# EAGLE board mainboard (EAGLE 9.1.3)
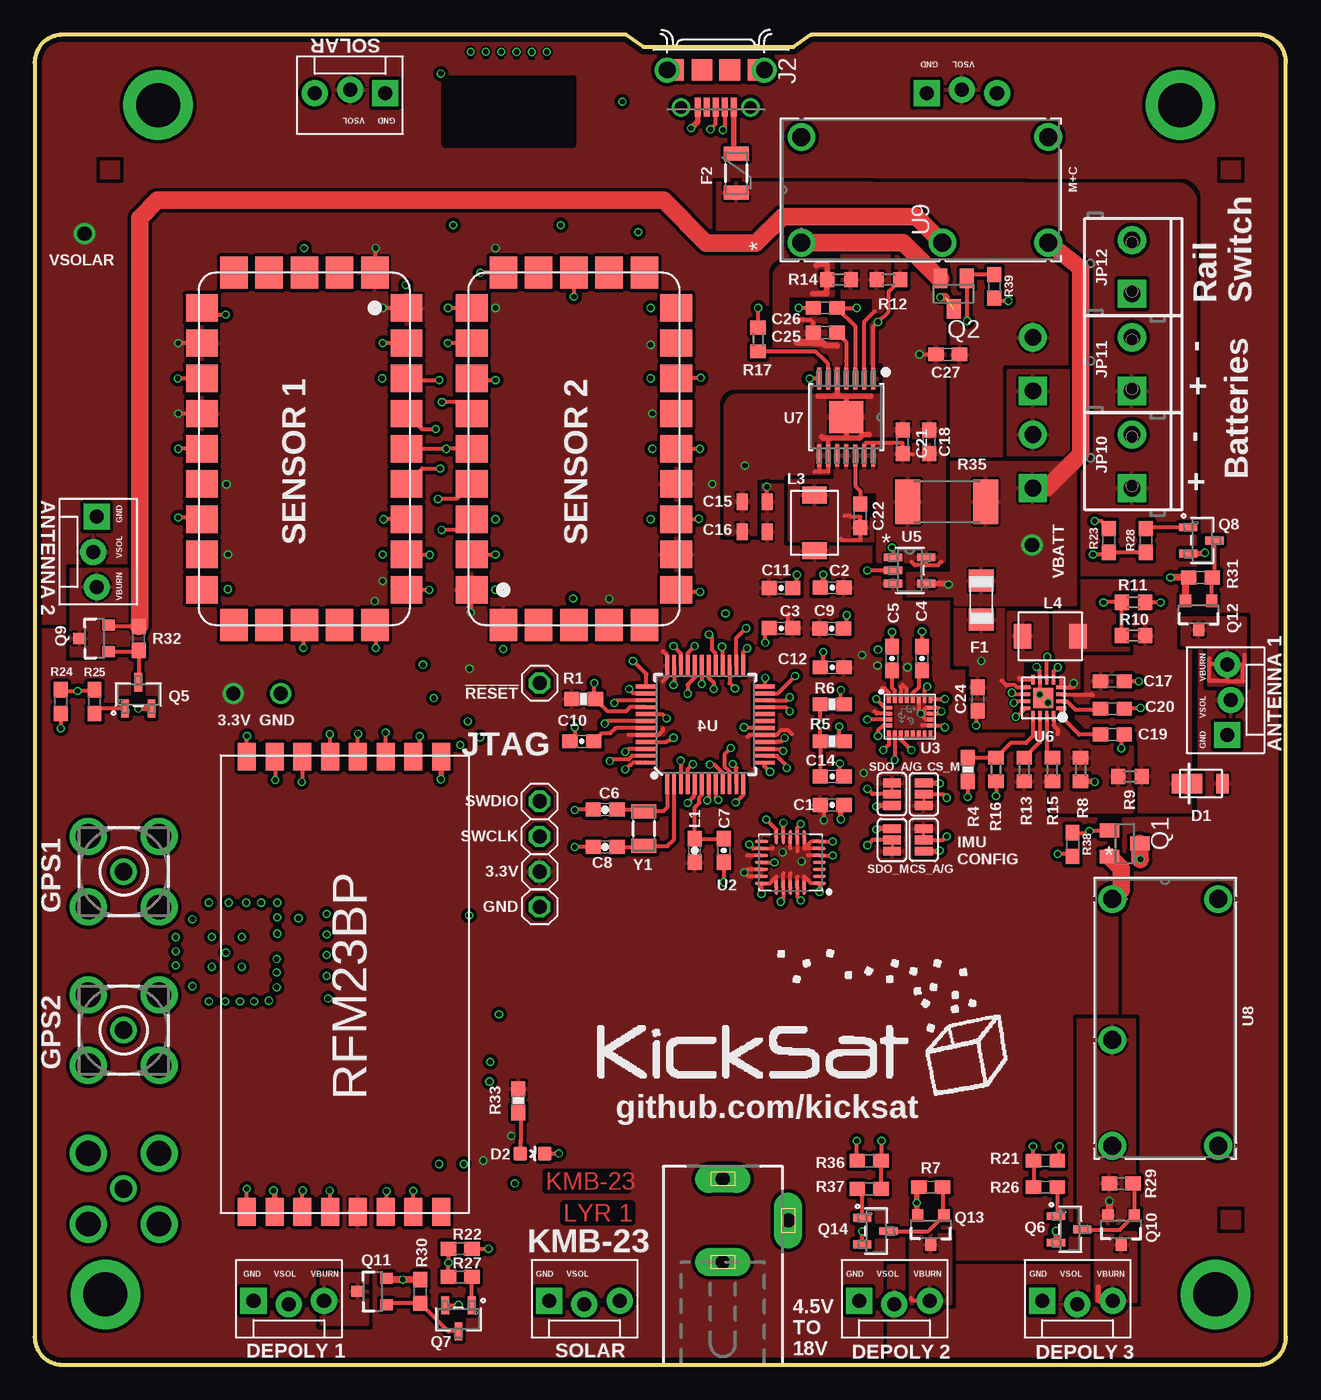
[diagram p5: board, top side]
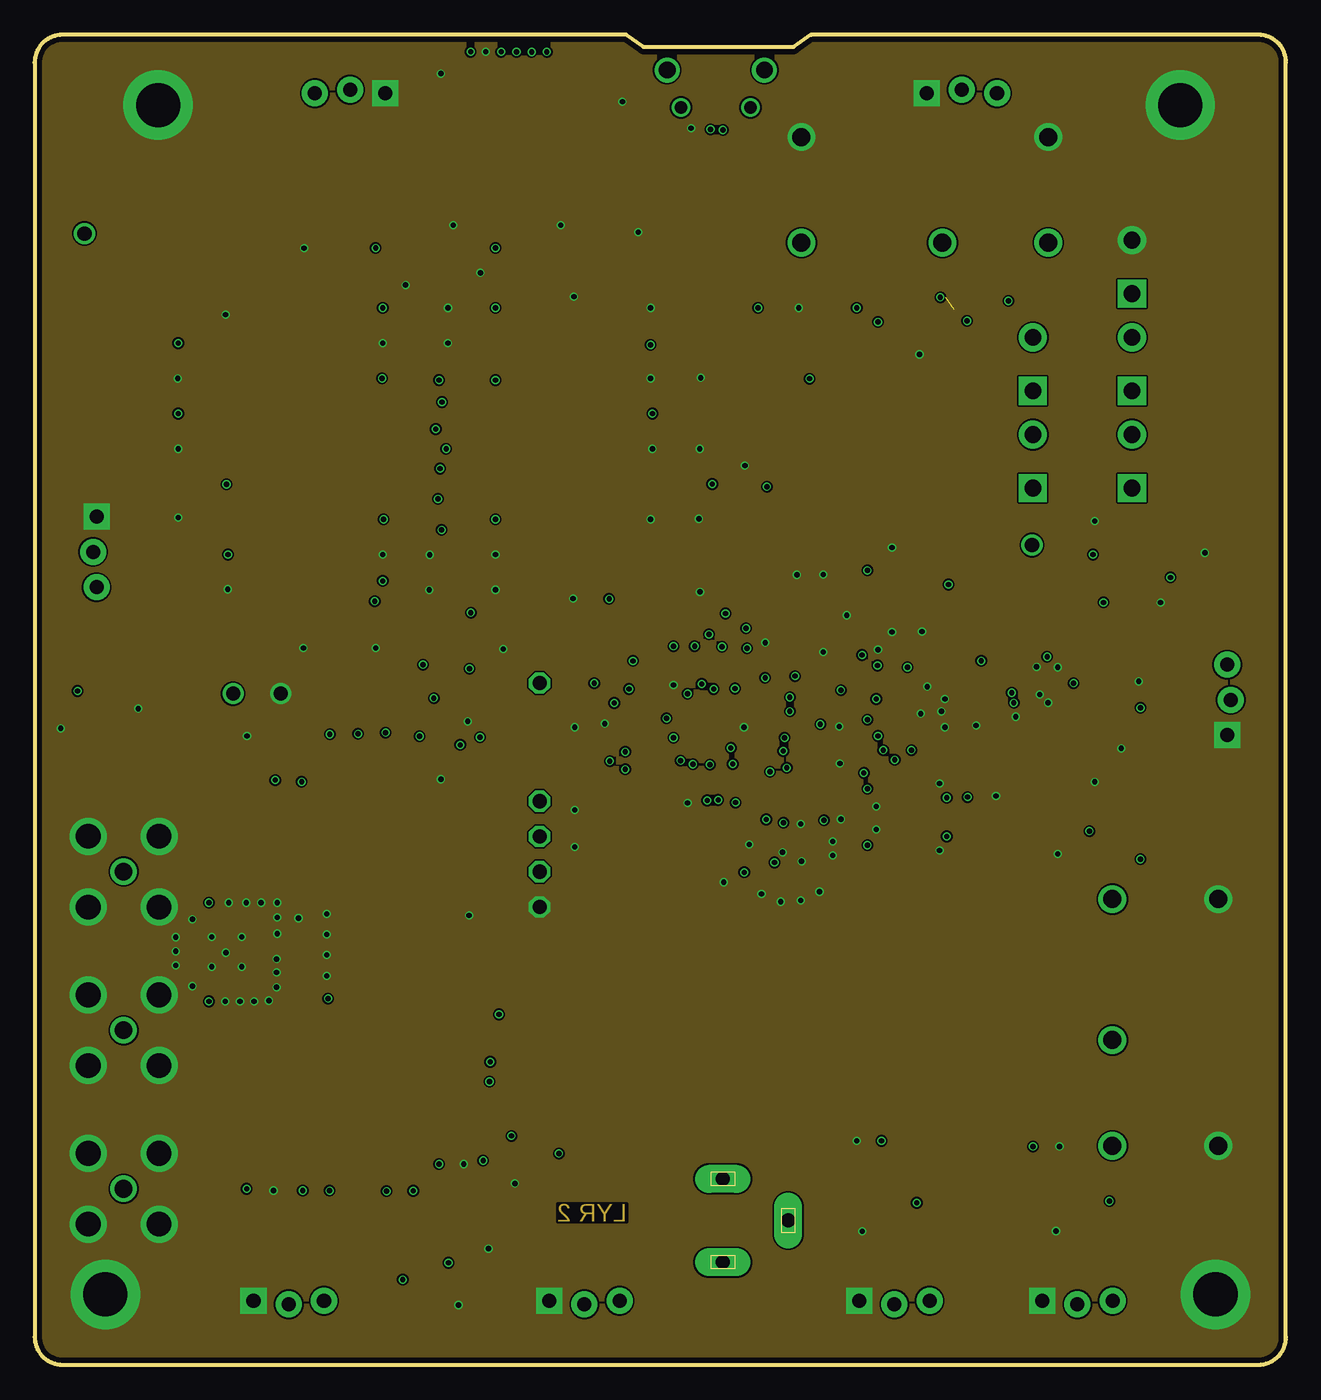
[diagram p6: board, inner layer Route2]
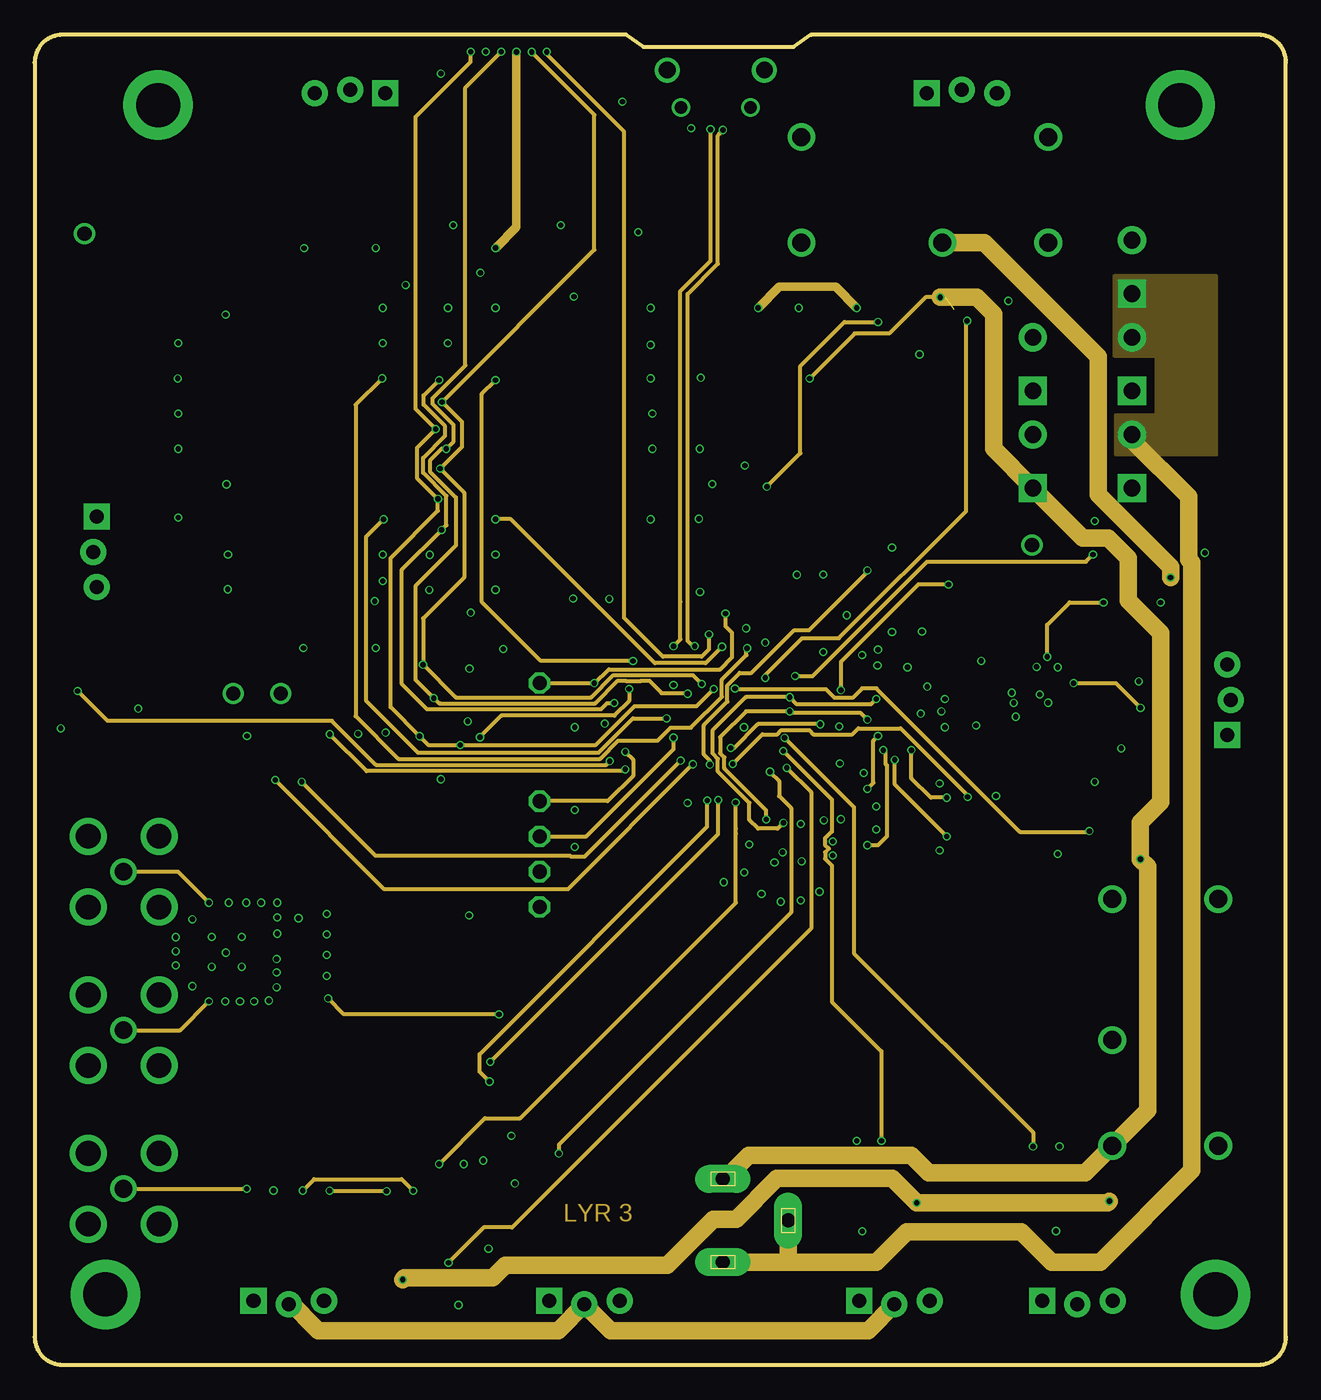
[diagram p7: board, inner layer Route15]
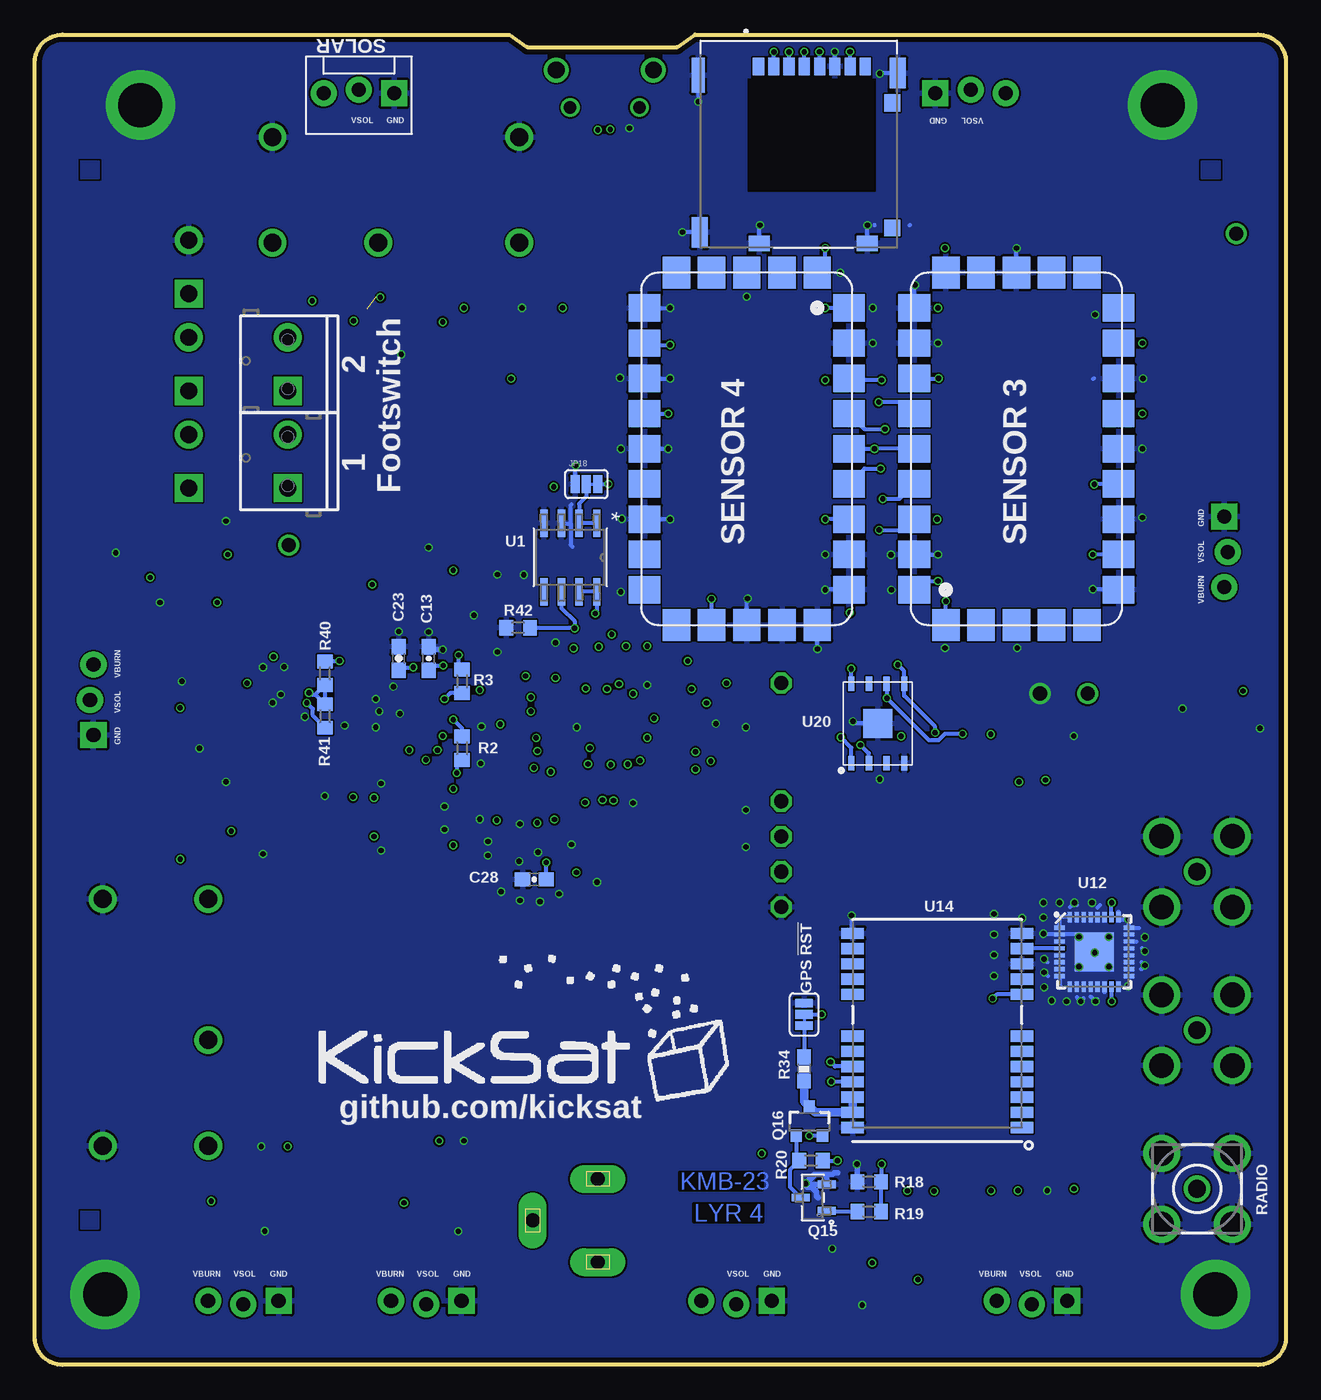
[diagram p8: board, bottom side, seen from below]

Size 90.17 x 95.89 mm. Coordinates in mm from the lower left corner, seen from the top.
Outline: 0,93.89 0,2 arc90 2,0 88.17,0 arc90 90.17,2 90.17,93.89 arc90 88.17,95.89 55.94,95.88 54.67,94.99 43.88,94.99 42.59,95.89 2,95.89 arc90 0,93.89
Copper layers (1*2*15*16): Top 0.035559375mm / dielectric 0.17018125mm / Route2 0.01778125mm / dielectric 47mil / Route15 0.01778125mm / dielectric 0.17018125mm / Bottom 0.035559375mm
Design rules "oshpark-4layer *": minimum track width 5mil, minimum drill 10mil, track to track 5mil, track to pad 5mil, pad to pad 5mil, via to via 5mil, smd to smd 5mil, copper to edge 15mil, drill to drill 6mil, minimum pad ring 4mil, minimum via ring 4mil, stop-mask expansion 2.5mil, vias tented up to drill 0mil, thermal gap 7mil
Net classes: 0 default: width 0.272 mm, drill 0.381 mm, clearance 0.127 mm

## Footprints (pad centres in the part's own frame; a part is rotated, then mirrored left to right if it is on the bottom)
1X01 = drill 1.016 octagon: 1 0,0
0603-CAP = smd 1.1 x 1: 1 -0.85,0; 2 0.85,0
0603-CAP@1 = smd 1.1 x 1: 1 -0.85,0; 2 0.85,0
0805 = smd 0.8 x 1.2: 1 -0.9,0; 2 0.9,0
0603 = smd 1.1 x 1: 1 -0.85,0; 2 0.85,0
PWRDI-123 = smd 0.9 x 1.4: A 1.45,0 | smd 2.2 x 1.4: C -1.1,0
LED-0603 = smd 1 x 1: A 0,-0.877; C 0,0.877
1206 = smd 1.6 x 1.8: 1 -1.4,0; 2 1.4,0
PTC-1206 = smd 1 x 1.8: 1 -1.4,0; 2 1.4,0
MOLEX_503182-1852 = smd 0.8 x 1.24: 1 -2.9,6.355; 2 -1.8,6.355; 3 -0.7,6.355; 4 0.4,6.355; 5 1.5,6.355; 6 2.6,6.355; 7 3.7,6.355; 8 4.8,6.355 | smd 1.16 x 1.2: DT 6.74,-5.275 | smd 0.95 x 2.5: P1 -7.245,5.725 | smd 1.15 x 2.2: P2 7.145,5.875; P3 -7.145,-5.605 | smd 1.5 x 1.15: P4 -2.84,-6.4; P5 4.94,-6.4 | smd 1.16 x 1.25: SW 6.74,3.725
FRAMATOME_10118194-0001LF = smd 0.45 x 1.35: 1 -1.3,2.675; 2 -0.65,2.675; 3 0,2.675; 4 0.65,2.675; 5 1.3,2.675 | drill 0.9: P$6 -2.5,2.7; P$7 2.5,2.7 | drill 1.2: P$8 -3.5,0; P$9 3.5,0 | smd 1.5 x 1.55: P$10 -1,0; P$11 1,0; P$12 -3.05,0; P$13 3.05,0
DCJ0303 = drill 1 pad 2 long: 1 0,3; 2 4.7,0; 3 0,-3
PAD-JUMPER-3-2OF3_NC_BY_TRACE_YES_SILK_FULL_BOX = smd 0.635 x 1.27: 1 -0.813,0; 2 0,0; 3 0.813,0
MOLEX-1X3_LOCK = drill 1.016 pad 1.88 square: 1 0,0.127 | drill 1.016 pad 1.88: 2 2.54,-0.127; 3 5.08,0.127
SCREWTERMINAL-3.5MM-2_LOCK = drill 1.2 pad 2.032 square: 1 -0.178,0 | drill 1.2 pad 2.032: 2 3.678,0
1812 = smd 1.25 x 1.75: P$1 -2,0; P$2 2,0
SOT23 = smd 1 x 1.4: 1 -0.95,-1.1; 2 0.95,-1.1; 3 0,1.1
SOT-23 = smd 0.559 x 1.321: 1 -0.953,-1.003; 2 0.953,-1.003; 3 0,0.876
SOT23-3 = smd 0.8 x 0.9: 1 -0.95,-1; 2 0.95,-1; 3 0,1.1
0603-RES = smd 1.1 x 1: 1 -0.85,0; 2 0.85,0
R0603 = smd 1 x 1.1: 1 -0.85,0; 2 0.85,0
R2512 = smd 1.8 x 3.2: 1 -2.8,0; 2 2.8,0
SO8 = smd 1.981 x 0.533: 1 -2.464,1.905; 2 -2.464,0.635; 3 -2.464,-0.635; 4 -2.464,-1.905; 5 2.464,-1.905; 6 2.464,-0.635; 7 2.464,0.635; 8 2.464,1.905
QFN50P456X400X100-24 = smd 0.998 x 0.22: 1 -2.086,1.5; 2 -2.086,1; 3 -2.086,0.5; 4 -2.086,0; 5 -2.086,-0.5; 6 -2.086,-1; 7 -2.086,-1.5; 13 2.086,-1.5; 14 2.086,-1; 15 2.086,-0.5; 16 2.086,0; 17 2.086,0.5; 18 2.086,1; 19 2.086,1.5 | smd 0.22 x 1.062: 8 -1,-1.819; 9 -0.5,-1.819; 10 0,-1.819; 11 0.5,-1.819; 12 1,-1.819; 20 1,1.819; 21 0.5,1.819; 22 0,1.819; 23 -0.5,1.819; 24 -1,1.819
LGA24-8X4 = smd 0.27 x 0.45: 1 -1.505,1.225; 6 -1.505,-1.225; 7 -1.075,-1.225; 8 -0.645,-1.225; 9 -0.215,-1.225; 10 0.215,-1.225; 11 0.645,-1.225; 12 1.075,-1.225; 13 1.505,-1.225; 18 1.505,1.225; 19 1.075,1.225; 20 0.645,1.225; 21 0.215,1.225; 22 -0.215,1.225; 23 -0.645,1.225; 24 -1.075,1.225 | smd 0.45 x 0.27: 2 -1.475,0.645; 3 -1.475,0.215; 4 -1.475,-0.215; 5 -1.475,-0.645; 14 1.475,-0.645; 15 1.475,-0.215; 16 1.475,0.215; 17 1.475,0.645
TQFP-48 = smd 1.5 x 0.28: 1 -4.25,2.75; 2 -4.25,2.25; 3 -4.25,1.75; 4 -4.25,1.25; 5 -4.25,0.75; 6 -4.25,0.25; 7 -4.25,-0.25; 8 -4.25,-0.75; 9 -4.25,-1.25; 10 -4.25,-1.75; 11 -4.25,-2.25; 12 -4.25,-2.75; 25 4.25,-2.75; 26 4.25,-2.25; 27 4.25,-1.75; 28 4.25,-1.25; 29 4.25,-0.75; 30 4.25,-0.25; 31 4.25,0.25; 32 4.25,0.75; 33 4.25,1.25; 34 4.25,1.75; 35 4.25,2.25; 36 4.25,2.75 | smd 0.28 x 1.5: 13 -2.75,-4.25; 14 -2.25,-4.25; 15 -1.75,-4.25; 16 -1.25,-4.25; 17 -0.75,-4.25; 18 -0.25,-4.25; 19 0.25,-4.25; 20 0.75,-4.25; 21 1.25,-4.25; 22 1.75,-4.25; 23 2.25,-4.25; 24 2.75,-4.25; 37 2.75,4.25; 38 2.25,4.25; 39 1.75,4.25; 40 1.25,4.25; 41 0.75,4.25; 42 0.25,4.25; 43 -0.25,4.25; 44 -0.75,4.25; 45 -1.25,4.25; 46 -1.75,4.25; 47 -2.25,4.25; 48 -2.75,4.25
21-0057F = smd 1.321 x 0.559: 1 -1.194,0.95; 2 -1.194,0; 3 -1.194,-0.95; 4 1.194,-0.95; 5 1.194,0.95
QFN-16-PAD = smd 0.7 x 0.25: P$1 -1.3,0.75; P$2 -1.3,0.25; P$3 -1.3,-0.25; P$4 -1.3,-0.75; P$9 1.3,-0.75; P$10 1.3,-0.25; P$11 1.3,0.25; P$12 1.3,0.75 | smd 0.25 x 0.7: P$5 -0.75,-1.3; P$6 -0.25,-1.3; P$7 0.25,-1.3; P$8 0.75,-1.3; P$13 0.75,1.3; P$14 0.25,1.3; P$15 -0.25,1.3; P$16 -0.75,1.3 | smd 1.45 x 1.45: P$17 0,0
PWP14_2P31X2P46-L = smd 1.6 x 0.305: 1 -2.769,1.95; 2 -2.769,1.3; 3 -2.769,0.65; 4 -2.769,0; 5 -2.769,-0.65; 6 -2.769,-1.3; 7 -2.769,-1.95; 8 2.769,-1.95; 9 2.769,-1.3; 10 2.769,-0.65; 11 2.769,0; 12 2.769,0.65; 13 2.769,1.3; 14 2.769,1.95 | smd 2.31 x 2.46: 15 0,0
RELAY5-PE_CO = drill 1.295 pad 2.007: 1 -7.62,17.196; 5 0,17.196; 11 -7.62,7.036; 12 0,-0.584; 14 -7.62,-0.584
QFN32-5X5MM = smd 0.762 x 0.305: 1 -2.5,1.75; 2 -2.5,1.25; 3 -2.5,0.75; 4 -2.5,0.25; 5 -2.5,-0.25; 6 -2.5,-0.75; 7 -2.5,-1.25; 8 -2.5,-1.75; 17 2.5,-1.75; 18 2.5,-1.25; 19 2.5,-0.75; 20 2.5,-0.25; 21 2.5,0.25; 22 2.5,0.75; 23 2.5,1.25; 24 2.5,1.75 | smd 0.305 x 0.762: 9 -1.75,-2.5; 10 -1.25,-2.5; 11 -0.75,-2.5; 12 -0.25,-2.5; 13 0.25,-2.5; 14 0.75,-2.5; 15 1.25,-2.5; 16 1.75,-2.5; 25 1.75,2.5; 26 1.25,2.5; 27 0.75,2.5; 28 0.25,2.5; 29 -0.25,2.5; 30 -0.75,2.5; 31 -1.25,2.5; 32 -1.75,2.5 | smd 2.794 x 2.794: EP 0,0
RFM23BP = smd 2 x 1.3: ANT 16.9,-7.5; GND1 -15.9,6.5; GND2 -15.9,-7.5; GND3 16.9,-5.5; GPIO_0 16.9,2.5; GPIO_1 16.9,4.5; GPIO_2 16.9,6.5; NIRQ -15.9,-3.5; NSEL -15.9,-1.5; RXON 16.9,-1.5; SCK -15.9,0.5; SDI -15.9,2.5; SDN -15.9,-5.5; SDO -15.9,4.5; TXON 16.9,-3.5; VCC 16.9,0.5
S1216_24PIN_PACKAGE = smd 1.626 x 0.813: 1 5.85,-7.62; 2 5.85,-6.52; 3 5.85,-5.42; 4 5.85,-4.32; 5 5.85,-3.22; 6 5.85,-2.12; 7 5.85,-1.02; 8 5.85,1.98; 9 5.85,3.08; 10 5.85,4.18; 11 5.85,5.28; 12 5.85,6.38; 13 -6.35,6.38; 14 -6.35,5.28; 15 -6.35,4.18; 16 -6.35,3.08; 17 -6.35,1.98; 18 -6.35,-1.02; 19 -6.35,-2.12; 20 -6.35,-3.22; 21 -6.35,-4.32; 22 -6.35,-5.42; 23 -6.35,-6.52; 24 -6.35,-7.62
XTB28_MEZ = smd 2.286 x 1.981: P$1 0.254,2.54; P$2 0.254,5.08; P$3 0.254,7.62; P$4 0.254,10.16; P$5 0.254,12.7; P$6 0.254,15.24; P$7 0.254,17.78; P$8 0.254,20.32; P$9 0.254,22.86; P$15 14.986,22.86; P$16 14.986,20.32; P$17 14.986,17.78; P$18 14.986,15.24; P$19 14.986,12.7; P$20 14.986,10.16; P$21 14.986,7.62; P$22 14.986,5.08; P$23 14.986,2.54 | smd 1.981 x 2.286: P$10 2.54,25.4; P$11 5.08,25.4; P$12 7.62,25.4; P$13 10.16,25.4; P$14 12.7,25.4; P$24 12.7,0; P$25 10.16,0; P$26 7.62,0; P$27 5.08,0; P$28 2.54,0
SON127P600X500X90-9N = smd 1.05 x 0.45: 1 -2.85,1.905; 2 -2.85,0.635; 3 -2.85,-0.635; 4 -2.85,-1.905; 5 2.85,-1.905; 6 2.85,-0.635; 7 2.85,0.635; 8 2.85,1.905 | smd 2.1 x 2.1: 9 0,0
BU-SMA-V = drill 1.27: 1 0,0 | drill 1.778: 2 -2.55,2.55; 3 2.55,2.55; 4 2.55,-2.55; 5 -2.55,-2.55
CRYSTAL-SMD-3.2X1.5MM = smd 1 x 1.8: P$1 -1.25,0; P$2 1.25,0

## Placement (x,y rotation side)
3.3V  [1X01]  36.38,35.55 0 top
C1  10uF  [0603-CAP]  57.46,40.35 0 top
C2  0.1uF  [0603-CAP]  57.46,56.02 180 top
C3  0.1uF  [0603-CAP]  53.78,53.1 180 top
C4  10nF  [0603-CAP]  63.94,50.92 90 top
C5  0.1uF  [0603-CAP]  61.78,50.92 90 top
C6  15pF  [0603-CAP@1]  41.11,40.02 0 top
C7  0.1uF  [0603-CAP]  49.65,37.07 270 top
C8  15pF  [0603-CAP@1]  41.11,37.33 180 top
C9  0.1uF  [0603-CAP]  57.44,53.08 0 top
C10  0.1uF  [0603-CAP]  39.43,44.95 180 top
C11  0.1uF  [0603-CAP]  53.78,56 0 top
C12  0.1uF  [0603-CAP]  57.46,50.28 180 top
C13  0.1uF  [0603-CAP]  61.78,50.92 90 bottom
C14  0.1uF  [0603-CAP]  57.46,42.41 0 top
C15  22uF  [0805]  51.88,62.22 0 top
C16  22uF  [0805]  51.88,60.06 0 top
C17  10uF  [0603]  77.66,49.28 0 top
C18  10uF  [0603]  64.45,66.54 90 top
C19  2.2uF  [0603]  77.66,45.44 0 top
C20  22nF  [0603]  77.66,47.29 0 top
C21  10uF  [0603]  62.54,66.54 90 top
C22  0.1uF  [0603]  59.5,61.2 90 top
C23  .1uF  [0603-CAP@1]  63.94,50.92 90 bottom
C24  22uF  [0603]  67.97,48 270 top
C25  3.3nF  [0603]  56.96,74.41 180 top
C26  1.0uF  [0603]  56.96,76.19 180 top
C27  2.2uF  [0603]  65.8,72.84 180 top
C28  0.1uF  [0603-CAP]  54.16,34.99 0 bottom
D1  DFLS130L  [PWRDI-123]  84.13,41.9 0 top
D2  GREEN  [LED-0603]  35.87,15.23 270 top
F1  1206L200  [1206]  68.21,55.13 90 top
F2  500mA  [PTC-1206]  50.56,85.89 270 top
FRAME1  FRAME-LETTER  [CREATIVE_COMMONS]  -4.77,87.11 0 top  (outside the outline)
FRAME2  FRAME-LETTER  [CREATIVE_COMMONS]  -4.46,78.22 0 top  (outside the outline)
FRAME3  FRAME-LETTER  [CREATIVE_COMMONS]  -4.77,60.44 0 top  (outside the outline)
FRAME4  FRAME-LETTER  [CREATIVE_COMMONS]  -4.77,69.33 0 top  (outside the outline)
FRAME5  FRAME-LETTER  [CREATIVE_COMMONS]  -4.77,54.85 0 top  (outside the outline)
GND  [1X01]  36.38,33.01 0 top
J1  503182-1852  [MOLEX_503182-1852]  35.11,87.24 0 bottom
J2  10118194-0001LF  [FRAMATOME_10118194-0001LF]  49.08,93.34 180 top
J3  DCJ0303  [DCJ0303]  49.59,10.4 0 top
JP1  [PAD-JUMPER-3-2OF3_NC_BY_TRACE_YES_SILK_FULL_BOX]  61.78,37.84 270 top
JP2  [PAD-JUMPER-3-2OF3_NC_BY_TRACE_YES_SILK_FULL_BOX]  61.78,41.14 90 top
JP3  [PAD-JUMPER-3-2OF3_NC_BY_TRACE_YES_SILK_FULL_BOX]  64.07,41.14 270 top
JP4  [PAD-JUMPER-3-2OF3_NC_BY_TRACE_YES_SILK_FULL_BOX]  64.07,37.84 90 top
JP5  [MOLEX-1X3_LOCK]  86.06,45.39 90 top
JP6  [MOLEX-1X3_LOCK]  4.34,61.14 270 top
JP7  [MOLEX-1X3_LOCK]  59.41,4.49 0 top
JP8  [MOLEX-1X3_LOCK]  72.6,4.49 0 top
JP9  [MOLEX-1X3_LOCK]  15.77,4.49 0 top
JP10  M023.5MM_LOCK  [SCREWTERMINAL-3.5MM-2_LOCK]  79.07,63.38 90 top
JP11  M023.5MM_LOCK  [SCREWTERMINAL-3.5MM-2_LOCK]  79.07,70.38 90 top
JP12  M023.5MM_LOCK  [SCREWTERMINAL-3.5MM-2_LOCK]  79.07,77.39 90 top
JP13  M023.5MM_LOCK  [SCREWTERMINAL-3.5MM-2_LOCK]  71.93,70.38 90 bottom
JP14  [MOLEX-1X3_LOCK]  37.07,4.49 0 top
JP15  [MOLEX-1X3_LOCK]  64.27,91.79 180 bottom
JP16  M023.5MM_LOCK  [SCREWTERMINAL-3.5MM-2_LOCK]  71.93,63.38 90 bottom
JP17  [MOLEX-1X3_LOCK]  25.27,91.79 180 top
JP18  [PAD-JUMPER-3-2OF3_NC_BY_TRACE_YES_SILK_FULL_BOX]  50.42,63.49 0 bottom
JP24  [PAD-JUMPER-3-2OF3_NC_BY_TRACE_YES_SILK_FULL_BOX]  34.73,25.26 270 bottom
JP25  [1X01]  36.38,40.63 90 top
JP26  [1X01]  36.38,38.09 90 top
JP27  [1X01]  36.38,49.14 0 top
L1  FB - 30Ohm  [0603]  47.56,37.07 90 top
L2  KICKSAT_LOGO  [KICKSAT_LOGO]  40.07,19.17 0 top
L3  3.3uH  [1812]  56.19,60.7 90 top
L4  56uH  [1812]  73.19,52.52 180 top
L5  KICKSAT_LOGO  [KICKSAT_LOGO]  70.16,18.79 0 bottom
Q1  BC846  [SOT23]  78.55,37.58 270 top
Q2  BC846  [SOT23]  66.23,77.21 180 top
Q5  IRLML2803  [SOT-23]  7.46,48.32 0 top
Q6  IRLML2803  [SOT-23]  74.61,9.77 270 top
Q7  IRLML2803  [SOT-23]  30.54,3.29 180 top
Q8  IRLML2803  [SOT-23]  84.13,59.43 270 top
Q9  IRLML5103  [SOT23-3]  4.32,52.37 90 top
Q10  IRLML5103  [SOT23-3]  78.29,9.77 180 top
Q11  IRLML5103  [SOT23-3]  24.36,5.29 90 top
Q12  IRLML5103  [SOT23-3]  83.88,54.09 180 top
Q13  IRLML5103  [SOT23-3]  64.58,9.77 180 top
Q14  IRLML2803  [SOT-23]  60.64,9.64 270 top
Q15  IRLML2803  [SOT-23]  34.1,12.06 90 bottom
Q16  IRLML5103  [SOT23-3]  34.35,17.52 0 bottom
R1  10K  [0603-RES]  39.56,48 180 top
R2  4.7k  [R0603]  59.37,44.44 270 bottom
R3  4.7k  [R0603]  59.37,49.27 90 bottom
R4  10k  [0603-RES]  67.24,42.92 270 top
R5  110K  [0603-RES]  57.46,44.95 180 top
R6  316K  [0603-RES]  57.46,47.62 0 top
R7  100k  [0603]  64.58,12.82 180 top
R8  100K  [R0603]  75.37,42.92 270 top
R9  40.9K  [R0603]  78.93,42.41 0 top
R10  330K  [R0603]  79.18,52.57 0 top
R11  43K  [R0603]  79.18,54.97 180 top
R12  73.2K  [R0603]  61.53,78.22 0 top
R13  470k  [R0603]  71.31,42.92 270 top
R14  22.1k  [R0603]  57.97,78.22 0 top
R15  4.7k  [R0603]  73.34,42.92 270 top
R16  6.04K  [R0603]  69.28,42.92 90 top
R17  100K  [R0603]  52.13,73.9 90 top
R18  10K  [R0603]  30.03,13.2 180 bottom
R19  4.7K  [R0603]  30.03,11.04 180 bottom
R20  3.3K  [R0603]  34.22,14.72 180 bottom
R21  10k  [0603]  72.83,14.72 0 top
R22  10k  [0603]  30.67,8.37 0 top
R23  10k  [0603]  77.4,59.43 90 top
R24  10k  [0603]  1.87,47.81 270 top
R25  4.7k  [0603]  4.31,47.81 90 top
R26  4.7k  [0603]  72.83,12.82 180 top
R27  4.7k  [0603]  30.67,6.34 180 top
R28  4.7k  [0603]  80.07,59.43 270 top
R29  100k  [0603]  78.29,13.07 180 top
R30  100k  [0603]  27.79,5.29 90 top
R31  100k  [0603]  84.01,56.76 180 top
R32  100k  [0603]  7.49,52.37 90 top
R33  330  [0603-RES]  34.86,19.04 90 top
R34  10K  [0603-RES]  34.73,21.33 270 bottom
R35  0.025  [R2512]  65.72,62.22 0 top
R36  10k  [0603]  60.13,14.72 180 top
R37  4.7k  [0603]  60.13,12.69 0 top
R38  10k  [0603]  74.79,37.5 270 top
R39  10k  [0603]  69.16,77.74 270 top
R40  2.1M  [R0603]  69.25,49.85 270 bottom
R41  845K  [R0603]  69.25,46.77 90 bottom
R42  10k  [R0603]  55.33,53.14 0 bottom
U1  MAX706R  [SO8]  51.58,58.2 270 bottom
U2  FXAS21002FXAS21002  [QFN50P456X400X100-24]  54.45,36.21 180 top
U3  LSM9DS1  [LGA24-8X4]  63.05,46.73 0 top
U4  ATSAMD21G-A  [TQFP-48]  48.32,46.15 90 top
U5  MAX4372TEUK+T  [21-0057F]  63.05,57.27 0 top
U6  LTC4121-4.2  [QFN-16-PAD]  72.68,48.08 180 top
U7  TPS54226PWPRPWP14_2P31X2P46-L  [PWP14_2P31X2P46-L]  58.48,68.32 270 top
U8  PE014006  [RELAY5-PE_CO]  85.28,16.37 0 top
U9  PE014006  [RELAY5-PE_CO]  72.45,88.51 90 top
U12  EP2W+  [QFN32-5X5MM]  13.83,29.77 0 bottom
U13  RFM23BP  [RFM23BP]  22.79,27.93 270 top
U14  S1216V8  [S1216_24PIN_PACKAGE]  24.88,24.72 0 bottom
U15  XTB_2018_07_15  [XTB28_MEZ]  27.05,78.73 180 top
U16  XTB_2018_07_15  [XTB28_MEZ]  31.24,53.33 0 top
U17  XTB_2018_07_15  [XTB28_MEZ]  27.05,53.33 0 bottom
U18  XTB_2018_07_15  [XTB28_MEZ]  31.24,78.73 180 bottom
U20  MR25H40MDF  [SON127P600X500X90-9N]  29.42,46.23 90 bottom
X1  BU-SMA-V  [BU-SMA-V]  6.41,35.55 270 top
X2  BU-SMA-V  [BU-SMA-V]  6.41,24.12 270 top
X3  BU-SMA-V  [BU-SMA-V]  6.41,12.69 0 bottom
Y1  32.768kHz  [CRYSTAL-SMD-3.2X1.5MM]  43.9,38.65 90 top

## Tracks (layer width: path | path; a pad name or v marks a point on that pad's centre or on a via)
3.3V  (via drill 0.38, 1.02)
  Top 0.272: U7.1 60.43,74.84 v60.77,75.17 61.53,75.94 61.53,77.37 R12.2 | 45.27,49.27 45.57,49.56 U4.36 45.57,51.13 45.27,51.43 | 42.81,45.4 U4.44 44.97,45.4 45.27,45.71 45.27,45.84 | U3.3 60.68,46.94 60.51,47.11 | C1.1 56.87,40.1 v56.87,39.25 | C9.1 56.8,53.29 | 51.38,45.27 51.52,45.4 U4.17 53.46,45.4 53.81,45.75 54.27,45.75 54.55,45.47 | 54.29,53.44 54.29,54.09 | U15.P$28 24.57,78.79 v24.57,80.51 | U15.P$1 v25.08,76.19 | U15.P$22 v10.35,73.65 | U15.P$20 v10.35,68.57 | U16.P$1 31.43,55.81 v31.43,54.22 | C15.2 52.7,62.29 52.7,63.24 v52.77,63.3 | U2.17 51.35,35.72 v51.14,35.5 51.42,35.22 U2.18 | U2.15 51.34,36.72 51.31,36.68
  Top 0.279: L1.1 47.72,36.21 | L3.P$1 56.23,58.66 | U3.22 62.84,48.72 62.54,49.01 62.41,48.88 U3.23 | 61.07,48.76 61.25,48.76 61.55,48.46 U3.1
  Route15 0.279: v52.77,63.3 55.18,65.71 55.18,72 58.35,75.17 v60.77,75.17
  Route15 0.61: v33.21,80.51 34.72,82.02 v34.72,94.65
  Bottom 0.272: C13.1 61.44,50.41 v60.74,50.41 | R3.2 59.62,50.37 v59.62,51.17 | R2.2 59.75,43.21 v59.75,42.66 | C23.1 63.73,50.28 v62.9,50.28 | R20.1 v32.32,14.72 | Q16.2 34.33,16.52 v34.35,16.5 | U18.P$1 v33.21,76.19 | U17.P$28 v24.51,55.04 | U17.P$1 26.16,56.51 v25.08,56.51 | U18.P$20 v44.51,68.57 | U18.P$22 46.1,73.52 v44.38,73.52 | U18.P$28 33.21,79.3 v33.21,80.51 | J1.4 34.72,93.6 v34.72,94.65 | JP18.3 v48.83,63.49 | U20.8 v31.32,50.17 v31.33,50.18 | U17.P$22 v13.93,58.41 | U17.P$20 13.8,63.49 v13.82,63.47 | U18.P$13 v41.4,55.21 v41.4,55.22
  other vias: 14.3,48.38
  pour Top (isolate 0.254, rank 6): 88.17,0 2,0 arc-90 0,2 0,93.89 arc-90 2,95.89 42.6,95.89 43.88,94.99 54.67,94.99 55.94,95.88 88.17,95.89 arc-90 90.17,93.89 90.17,2 arc-90
!RESET  (via drill 0.38)
  Top 0.272: v40.32,49.14 40.32,47.7 R1.1 41.3,47.11 42.61,47.11 42.9,47.4 U4.40
  Route15 0.272: 40.37,49.14 41.37,50.14 49.38,50.14 50.25,51.01 50.25,52.76 49.78,53.23 v49.78,54.16
  Route15 0.279: JP27.1 v40.32,49.14 40.37,49.14
  Bottom 0.272: v49.78,54.16 49.67,54.27 U1.8 U1.7
BURN_RELAY_A  (via drill 0.38)
  Top 0.272: U4.24 52.64,48.97 v52.64,49.52 | v67.19,75.25 67.18,75.27 Q2.1 67.46,78.59 R39.1
  Route15 0.279: v67.19,75.25 67.12,75.17 67.12,61.54 57.96,52.38 55.3,52.38 52.64,49.71 v52.64,49.52
BURN_RELAY_B  (via drill 0.38)
  Top 0.272: 77.29,38.53 77.23,38.47 77.02,38.47 | 77.02,38.47 v76.01,38.47 75.89,38.35 R38.1 | U4.27 50.07,49.15 v50.47,48.75 | Q1.1 77.08,38.53 77.02,38.47
  Route15 0.272: v50.47,48.75 50.51,48.71 57.01,48.71 57.64,48.08 58.93,48.08 59.63,48.77 60.65,48.77 71,38.42 75.95,38.42 v76.01,38.47
ENAB_BURN1  (via drill 0.38)
  Top 0.272: v41.45,43.52 41.56,43.63 42.78,43.63 43.06,43.9 U4.47 | R24.1 1.96,48.57 v3.09,48.57 4.22,48.57 R25.2
  Route15 0.272: v41.45,43.52 41.18,43.25 24.58,43.25 21.42,46.42 5.25,46.42 v3.09,48.57
ENAB_BURN2  (via drill 0.38)
  Top 0.272: R28.2 R23.1 77.24,58.41 v76.26,58.41 | U4.23 53.55,48.4 v54.8,49.65
  Route15 0.279: v76.26,58.41 75.75,57.9 64.32,57.9 56.06,49.65 v54.8,49.65
ENAB_BURN3  (via drill 0.38)
  Top 0.272: R22.1 v29.82,7.36 R27.2 | U4.14 53.48,43.9 54.2,43.19 v54.2,43.04
  Route15 0.272: v29.82,7.36 32.36,9.9 34.4,9.9 55.95,31.45 55.95,41.29 v54.2,43.04
ENAB_BURN4  (via drill 0.38)
  Top 0.272: R26.2 R21.1 71.94,14.76 v71.94,15.74 | U4.16 53.51,44.9 53.55,44.95 53.79,44.95 v54.04,45.2
  Route15 0.272: 71.94,16.75 v71.94,15.74
  Route15 0.279: 71.94,16.75 59.02,29.67 59.02,40.21 v54.04,45.2
ENAB_BURN5  (via drill 0.38)
  Top 0.272: R37.2 R36.1 61.03,14.77 61.03,16.13 v61.02,16.15 | U4.15 53.79,44.4 v53.95,44.25
  Route15 0.272: v61.02,16.15 61.02,22.6 57.44,26.17 57.44,36 56.95,36.48 56.95,36.94 57.23,37.22 56.95,37.49 56.95,37.95 57.44,38.45 57.44,40.75 v53.95,44.25
ENAB_GPS  (via drill 0.38)
  Top 0.272: U4.12 51.07,41.1 v50.51,40.53
  Route15 0.272: 50.53,38.65 50.53,40.51 v50.51,40.53
  Route15 0.279: 50.53,38.65 50.53,38.29 50.53,33.31 34.98,17.77 32.45,17.77 v29.14,14.47
  Bottom 0.272: R19.1 R18.1 29.14,13.24 v29.14,14.47
GND  (via drill 0.38, 1.02, 3.17 pad 5)
  Top 0.272: U3.16 65.17,46.94 v65.34,47.11 65.07,47.37 U3.17 64.24,47.37 64.09,47.22 64.09,47.09 63.94,46.94 | U3.15 64.24,46.51 64.09,46.66 64.09,46.7 v63.85,46.94 63.7,47.1 U3.20 | U6.P$12 70.77,46.72 v70.7,46.72 | v65.59,45.96 65.48,46.08 U3.14 64.52,46.09 63.94,46.09 | 68.26,46.73 C24.2 67.84,47.02 v67.84,46.09 | 58.23,42.5 C14.2 58.02,42.7 v58.02,43.35 | 58.23,45.04 R5.1 57.97,45.29 v57.97,46.02 | 61.62,51.93 C13.2 v61.78,52.82 | C4.2 v63.94,52.86 | v58.52,54.03 58.52,53.31 C9.2 | Q7.2 v30.54,4.31 | R22.2 v32.7,8.37 | C19.2 78.29,45.22 v78.29,44.44 | C17.2 v79.55,49.28 v79.56,49.27 | C12.2 56.83,50.5 v56.83,51.38 | R16.1 v69.28,41.01 | v38.92,45.96 38.92,45.29 C10.2 | R23.2 76.86,60.82 v76.39,60.82 | U13.GND2 v15.29,45.32 v15.3,45.33 | C26.2 v55.05,76.19 | C25.2 56.11,75.14 55.94,75.3 55.05,75.3 | v52.64,52.06 52.64,52.81 C3.2 | C11.2 54.92,56.29 v54.92,56.95 | 57.21,66.81 57.18,66.78 U7.9 57.18,64.41 57.21,64.38 56.58,64.38 | 56.58,64.38 56.19,64.38 | U7.8 56.53,64.42 56.58,64.38 | U4.42 41.27,46.4 v41.08,46.22 | U5.1 61.86,58.84 v61.78,58.92 | R21.2 73.85,14.89 v73.85,15.74 | R36.2 59.24,14.76 v59.24,16.15 | U15.P$19 v10.35,66.03 | U15.P$17 11.93,61.08 v10.35,61.08 | U15.P$12 19.36,53.27 v19.36,51.68 | U18.P$8 v33.21,58.41 | U17.P$8 v25.08,73.65 | U4.5 47.57,41.15 47.5,41.08 47.5,40.95 v47.05,40.5 | R24.2 v1.87,45.89 v1.88,45.88 | U16.P$8 v29.78,73.65 | U15.P$23 12.54,75.71 v13.76,75.71 | U15.P$21 v10.31,71.11 v10.3,71.1 | U16.P$12 v38.86,77 | U16.P$10 v32.12,78.73 v32.12,78.72 | U16.P$9 v29.79,76.19 | U16.P$19 v47.92,66.03 v47.93,66.03 | U16.P$21 46.26,60.99 v47.86,60.99 | U16.P$23 46.38,55.72 v47.94,55.72 | U15.P$8 28.45,58.41 v28.46,58.4
  Top 0.272: U15.P$9 v28.43,55.87 v28.44,55.87 | U16.P$17 46.27,71.15 v47.99,71.15 | Q14.2 v59.64,9.63 | 54.96,38.03 U2.9 | 54.45,37.23 U2.10 | U2.20 53.45,35.18 53.44,35.2 52.95,34.72 U2.19 52.37,33.95 v52.38,33.94 | 53.95,35.45 U2.21 53.95,33.58 v53.76,33.39 | U2.22 54.45,35.45 | 54.96,35.2 54.95,35.19 U2.23 54.95,33.72 v55.2,33.48 | U2.24 55.45,35.18 55.47,35.2 55.95,34.72 U2.1 56.56,34.7 v56.56,34.11 | U2.6 55.49,37.22 55.47,37.23 | 55.47,37.23 55.95,37.72 U2.7 v57.5,37.72 v57.51,37.72 | U2.8 55.45,37.25 55.47,37.23 | U2.9 54.95,37.03 54.97,37.01 | 53.18,37.23 53.17,37.22 U2.14 51.78,37.22 v51.49,37.51 | 55.72,36.72 56.53,36.72 U2.5 v57.51,36.72 v57.51,36.71 | v55.21,38.98 54.95,38.73 U2.9 | U15.P$10 24.57,53.27 v24.57,51.68 | R38.2 74.62,36.82 v73.72,36.82
  Top 0.279: C27.2 v63.76,72.84 | R11.1 81.11,54.98 v81.14,54.96 | v72.2,50.32 72.43,50.05 U6.P$7 v72.43,48.33 U6.P$17 73.03,47.73 v73.03,47.72 | U6.P$5 73.43,49.99 v73.72,50.28 | C7.2 v49.65,34.79 | U3.18 64.6,48 v65.59,48 | C6.1 38.95,40.02 v38.92,40 | C8.2 v38.92,37.33 | U3.16 63.94,46.94 v63.85,46.94 | U3.19 64.13,48.66 64.16,48.69 64.16,48.72 v64.32,48.89
  Top 0.305: U4.35 46.07,49.05 v46.03,49.01 | U4.18 51.17,45.9 v51.11,45.96
  Top 0.406: 58.48,66.81 U7.15 58.48,69.83 | 58.48,66.81 57.21,66.81 56.82,66.81 56.7,66.92 | 58.48,66.81 59.43,66.81 59.67,67.04 60.13,67.04 | 58.48,69.83 57.84,69.83 | 57.84,69.83 56.46,69.83 | 56.46,69.83 | 56.46,69.83 56.45,69.83 | 58.48,69.83 60.25,69.83 | 60.25,69.83 | 60.25,69.83 60.26,69.83 | 57.83,73.44 57.84,73.46 57,73.46 56.88,73.57 | 57.84,69.83 57.83,69.84 U7.5 | 57.12,79.33 R14.1 57.08,78.18 57.08,77.21 56.07,77.21 | 57.12,79.33 57.08,79.37 | Q5.2 7.47,47.32 v7.46,47.3 | Q6.2 73.61,9.63 v73.59,9.64 | Q8.2 84.27,58.47 v84.33,58.54 | J2.5 47.78,89.62 v47.3,89.14 | 57.12,79.33 56.41,79.33 56.32,79.24 | R8.2 76.35,42.07 v76.39,42.03 | U13.GND3 17.29,12.48 v17.2,12.56 | C2.2 56.83,56.24 v56.83,56.98 | C1.2 58.1,40.14 v58.1,39.34 | JP3.1 65.16,41.95 v65.21,41.9 | JP1.1 60.69,38.65 v60.64,38.6 | JP4.1 65.16,37.02 v65.21,37.07 | JP2.1 60.72,40.33 v60.64,40.25 | v29.27,42.22 29.29,42.24 U13.GND1
  Top 0.508: 56.07,74.45 C25.2 56.07,74.37 56.07,73.7 | 56.07,73.7 54.92,73.7 | 56.07,73.7 56.75,73.7 56.88,73.57
  Bottom 0.272: 15.08,31.02 U12.2 17.42,31.02 v17.48,31.08 | U12.29 14.03,32.22 | U12.30 14.54,32.31 | 17.17,28.02 v17.43,28.29 | 13.58,32.96 13.4,33.14 | 14.08,33.22 v13.98,33.32 | 15.08,33.14 v15.25,33.32 15.58,32.99 | 16.32,32.27 U12.32 15.59,32.26 | 16.32,32.27 16.46,32.27 16.57,32.38 | U12.1 16.32,31.53 16.32,32.27 | 17.2,29.02 v17.43,29.25 | 15.08,28.54 v14.92,28.69 | 14.58,26.42 v14.79,26.2 15.08,26.49 | 16.21,27.27 16.32,27.17 16.32,28.01 U12.8 | U12.14 13.08,26.85 | 13.58,26.35 v13.72,26.2 14.08,26.55 | 11.33,27.33 v11.36,27.3 | U12.16 12.01,27.33 | U12.24 11.33,32.08 v11.36,32.12 11.93,32.12 U12.25 | U12.25 12.08,32.68 | 11.29,31.49 10.6,31.49 | U12.23 11.19,31.02 | U12.22 10.78,30.52 | 10.38,30.02 v10.17,29.81 | 10.4,29.02 v10.17,28.79 10.44,28.52 | 12.59,28.52 v12.76,28.69 | 12.59,31.02 v12.76,30.85 | U12.25 12.09,32.26 | 27.12,82.15 27.11,82.16 | U17.P$9 26.79,77.78 v26.73,77.84 | U15.P$8 v25.08,58.41 | U18.P$9 v33.21,55.87 | U18.P$12 38.86,55.17 v38.8,55.24 | U16.P$21 v44.38,60.95 | U16.P$19 v44.51,66.03 | U16.P$17 v44.38,71.11 | U18.P$23 v44.38,76.19 | J1.P5 30.17,82.15 v30.16,82.16 | J1.P4 37.95,82.11 v37.91,82.16 | J1.P3 42.27,81.65 v43.49,81.65 | J1.P1 v42.36,91.06 v42.35,91.05 | J1.6 v32.51,94.66 | JP18.1 51.23,64.77 v51.18,64.82 | U1.3 52.18,60.63 51.56,60.63 | 51.56,60.63 51.56,61.97 51.5,62.03 | 51.56,60.63 51.56,59.11 51.43,58.98 | U20.9 31.06,46.23 v31.21,46.39 | 13.85,71.11 13.9,71.06 | U17.P$12 v19.43,80.48 v19.42,80.49 | v33.76,51.6 33.78,51.61 U18.P$10 | U17.P$23 13.88,55.87 v13.91,55.91
  Bottom 0.279: U14.13 31.3,31.17 v31.3,32.4
  Bottom 0.305: J1.P2 29.24,93.11 v29.27,93.08 | 29.64,82.15 29.65,82.16
  Bottom 0.406: R18.2 30.88,14.43 v30.92,14.47 | v34.6,13.07 34.54,13.01 Q15.2 33.09,13.7 33.08,13.72 | v34.6,13.07 34.6,12.94 34.45,12.79 34.12,12.79 33.86,12.52 33.86,12.2 33.72,12.06 | v34.6,13.07 33.96,13.72 33.08,13.72 | 33.08,13.72 32.68,13.72 32.57,13.83 32.32,13.83 | C13.2 61.57,51.55 v60.77,51.55
  other vias: 8.89,90.81 82.55,90.81 85.09,5.08 5.09,5.08 17.48,32.25 16.32,33.31 17.48,33.31 10.17,30.83 19.01,32.2 17.43,27.22 16.87,26.25 15.81,26.2 21.04,28.03 21.04,29.56 21.04,31.03 21.04,32.5 14.92,30.85 13.78,29.71 17.72,48.38 53.9,36.95 55.26,36.3
  pour Bottom (rank 2): 2,95.89 42.6,95.89 43.88,94.99 54.67,94.99 55.94,95.88 88.17,95.89 arc-90 90.17,93.89 90.17,2 arc-90 88.17,0 2,0 arc-90 0,2 0,93.89 arc-90
  pour Route2 (no thermals): 2,95.89 42.6,95.89 43.88,94.99 54.67,94.99 55.94,95.88 88.17,95.89 arc-90 90.17,93.89 90.17,2 arc-90 88.17,0 2,0 arc-90 0,2 0,93.89 arc-90
  pour Top (no thermals): 62.04,47.49 62.04,45.96 64.07,45.96 64.07,47.49
  pour Bottom: 8.95,35.55 34.35,35.55 34.35,3.8 11.49,3.8 11.49,19.04 8.95,19.04
  pour Top: 57.46,79.24 54.27,79.24 arc90 53.4,78.37 53.4,73.14 57.46,73.14 57.46,71.87 57.97,71.87 57.97,73.65 56.96,73.65 56.96,75.3 54.17,75.3 54.16,77.21 57.46,77.21
  pour Top (isolate 0.254, rank 3): 65.59,66.79 57.46,66.79 57.46,64 51.88,64 51.88,59.93 49.84,59.93 49.84,68.97 arc-90 50.71,69.84 57.59,69.84 57.59,72.38 56.58,73.4 56.58,73.65 58.1,73.65 58.1,69.84 61.27,69.84 61.27,72.38 60.39,72.38 60.39,75.56 61.53,75.56 61.53,79.37 63.21,79.37 arc-90 65.59,76.98
  pour Bottom (no thermals): 17.08,26.66 17.08,33.01 10.73,33.01 10.6,32.88 10.6,26.66
  pour Top: 53.18,37.48 55.98,37.48 55.98,34.94 52.93,34.94 52.93,37.48
  pour Bottom (no thermals): 30.03,95.75 38.16,95.75 38.16,94.48 30.03,94.48
GND4  (via drill 0.38)
  Top 0.272: v70.16,76.7 69.35,76.7 R39.2
GPS_PWR_IN
  Bottom 0.61: R34.2 34.73,19 Q16.3 33.94,18.2 U14.23 U14.22
I2C_SCL  (via drill 0.38)
  Top 0.272: v60.64,48 61.26,47.37 U3.2 | U4.22 54.2,47.9 v54.42,48.12 | U2.11 v53.95,39.07 v53.96,39.07
  Route15 0.272: v54.42,48.12 51.24,48.12 48.83,45.71 48.83,44.09 49.24,43.68 49.24,42.77 51.5,40.51 51.5,39.29 52.13,38.66 53.54,38.66 v53.96,39.07
  Route15 0.279: v60.64,48 60.26,47.62 54.92,47.62 v54.42,48.12
  Bottom 0.272: R3.1 60.22,48.42 v60.64,48
I2C_SDA  (via drill 0.38)
  Top 0.272: U4.21 54.12,47.4 v54.42,47.11 | U2.12 53.45,38.58 v52.72,39.32
  Top 0.279: U3.4 v60,46.51
  Route15 0.272: v54.42,47.11 51.26,47.11 49.4,45.25 49.4,44.08 49.7,43.78 49.7,43 52.72,39.98 v52.72,39.32
  Route15 0.279: v60,46.51 59.54,46.98 54.54,46.98 v54.42,47.11
  Bottom 0.272: R2.1 59.37,45.88 v60,46.51
I2C_SDOA/G  (via drill 0.38)
  Top 0.272: U3.5 61.14,46.08 60.77,45.71 v60.77,45.33
  Top 0.279: JP2.2 60.39,41.14 v60,41.52
  Route15 0.279: v60,41.52 60.43,41.95 60.43,45 v60.77,45.33
I_BATT  (via drill 0.38)
  Top 0.272: U4.9 49.57,42.67 48.97,43.27 v48.66,43.27
  Top 0.279: U5.2 v60,57.27
  Route15 0.272: v60,57.27 60,57.16 55.8,52.96 54.74,52.96 51.65,49.87 50.8,49.87 49.91,48.98 49.91,47.81 48.22,46.12 48.22,43.99 48.66,43.55 v48.66,43.27
L1_CHG
  Top 0.279: U6.P$16 73.43,46.09 | 73.43,46.09 73.47,46.09 | 73.43,46.09 73.72,45.8 73.72,45.46
  pour Top (isolate 0.254): 73.34,46.98 74.48,46.98 74.48,45.2 79.05,45.2 79.05,39.87 73.34,39.87
L1_FAULTN
  Top 0.272: R15.1 72.93,44.18 U6.P$15
L1_PROG
  Top 0.272: U6.P$13 71.93,45.32 71.43,44.82 70.33,44.82 R16.2 R4.1
LION1  (via drill 0.38)
  Top 0.272: U6.P$9 70.81,48.83 70.64,49 70,49 69.68,49.33
  Bottom 0.272: R40.1 69.21,50.74 v68.21,50.74
  pour Top (rank 3): 71.94,49.27 69.91,49.27 69.91,55.11 66.35,55.11 66.35,50.54 67.46,50.54 67.46,45.96 71.94,45.96
N$1
  Top 0.272: D2.A 35,16.18 35.03,16.22 35.03,18.02 R33.1
N$2
  Top 0.272: 63.73,49.98 C4.1
  Top 0.279: 63.73,49.98 63.73,48.87 63.27,48.41 U3.21
N$3
  Top 0.272: 58.35,61.2 58.75,61.2 58.84,61.11 59.5,61.11 C22.1 59.5,59.43 58.23,59.43 58.1,59.55
  pour Top (rank 2): 57.72,66.28 58.73,66.28 58.73,60.95 60.51,60.95 60.51,59.43 54.42,59.43 54.42,63.74 57.72,63.74
N$4
  pour Top: 74.99,71.62 70.16,71.62 70.16,65.65 74.99,65.65
N$5
  Top 0.272: R26.1 73.68,10.8 Q6.1
N$6
  Top 0.279: C5.1 61.78,48.8 61.98,48.6 U3.24
N$7
  Top 0.272: Q9.1 7.65,51.42 R32.1 7.49,49.22 Q5.3
N$8
  Bottom 0.272: JP18.2 50.41,62.6 50.94,62.08 U1.2 U1.1
N$9  (via drill 0.38)
  Route15 0.279: v33.46,25.26 22.29,25.26 v21.14,26.41
  Bottom 0.272: v33.46,25.26 JP24.2 34.73,25.16
  Bottom 0.279: U14.8 20.85,26.7 v21.14,26.41
N$10
  Bottom 0.272: R19.2 33.03,11.04 Q15.1
N$11
  Top 0.272: Q5.1 4.67,47.32 R25.1
N$12
  Bottom 0.272: Q16.1 35.3,14.95 R20.2 35.75,14.05 35.75,12.83 Q15.3
N$13  (via drill 0.38)
  Top 0.272: 56.61,44.82 R5.2 v56.61,46.18 R6.1 | 56.61,44.82 C14.1 56.44,42.24 | 56.53,44.9 56.61,44.82 | v50.16,44.46 49.74,44.04 49.74,43.08 50.07,42.76 U4.10
  Route15 0.272: v56.61,46.18 52.11,46.18 50.4,44.46 v50.16,44.46
N$14
  Top 0.279: U7.12 59.13,63.35 59.5,62.98 C22.2
N$15
  Top 0.272: Q12.1 84.83,56.73 R31.1 85.01,56.91 Q8.3
N$16  (via drill 0.38)
  Route15 0.279: X2.1 10.47,24.12 v12.56,26.2
  Bottom 0.279: U12.15 12.58,26.22 v12.56,26.2
N$17  (via drill 0.38)
  Route15 0.279: X1.1 10.32,35.55 v12.56,33.32
  Bottom 0.279: U12.26 12.58,33.3 v12.56,33.32
N$18
  Top 0.272: C7.1 L1.2 47.56,40.17
  Top 0.279: U4.6 48.07,41.08 47.9,40.92 47.9,40.52 47.56,40.17
N$19  (via drill 0.38)
  Top 0.279: U13.ANT 15.29,12.67 v15.28,12.69
  Route15 0.279: X3.1 v15.28,12.69
N$20
  Top 0.406: J2.1 50.38,87.47 F2.1
N$21  (via drill 0.38)
  Top 0.272: JP1.2 60.39,37.84 v60,37.46
  Top 0.279: U3.6 61.55,44.71 v61.15,44.31
  Route15 0.279: v60,37.46 60.77,37.46 61.4,38.09 61.4,43.22 61.3,43.33 61.3,44.17 v61.15,44.31
N$22  (via drill 0.38)
  Top 0.272: U2.16 v53.31,36.22 v53.31,36.21
  Bottom 0.272: C28.2 v53.31,36.21
N$23  (via drill 0.38)
  Top 0.279: JP3.2 65.47,41.14 v65.72,40.88 | U3.8 62.41,45.09 v63.18,44.31
  Route15 0.279: v65.72,40.88 64.58,40.88 63.18,42.28 v63.18,44.31
N$24
  Bottom 0.272: JP24.3 R34.1
N$25
  Top 0.272: R28.1 80.17,60.38 Q8.1
N$26  (via drill 0.38)
  Top 0.272: U3.7 v61.98,43.61
  Top 0.279: JP4.2 65.47,37.84 v65.72,38.09
  Route15 0.279: v65.72,38.09 61.98,41.83 v61.98,43.61
N$27
  pour Bottom (no thermals): 86.83,9.82 86.83,11.06 85.58,11.06 85.58,9.82
N$28
  Top 0.279: C6.2 43.73,40.02 Y1.P$2 45.3,39.9 45.57,40.17 U4.1
N$29
  Top 0.279: C8.1 43.68,37.33 Y1.P$1 45.6,37.4 46.07,37.87 U4.2
N$30
  Top 0.272: Q7.1 31.49,6.32 R27.1
N$31  (via drill 0.38)
  Top 0.272: U6.P$10 70.52,48.33 v70.41,48.45
  Bottom 0.272: v70.41,48.45 70.31,48.45 70.18,48.31 69.95,48.31 | 69.95,48.31 R40.2 R41.2 69.94,48.31 69.95,48.31
N$32  (via drill 0.38)
  Top 0.272: U6.P$4 74.55,48.83 v74.86,49.14 | C20.2 78.58,47.36 v79.69,47.36
  Top 0.279: 73.97,49.52 U6.P$4 74.86,48.83 v74.86,49.14
  Route15 0.279: v74.86,49.14 77.91,49.14 v79.69,47.36
  pour Top (isolate 0.254, rank 2, no thermals): 73.47,54.6 73.47,48.89 74.74,48.89 74.86,48.76 75.24,48.76 75.24,51.55 78.8,51.55 78.8,56.45 75.24,56.45 75.24,54.6
N$33
  Top 0.272: 74.99,47.23 76.75,47.23 C20.1
  Top 0.279: U6.P$2 74.4,47.83 74.99,47.23
N$34
  Top 0.272: C19.1 75.26,45.44 73.97,46.73 | U6.P$1 73.98,46.73
  Top 0.279: 73.97,46.73 73.98,46.73 73.98,47.31
N$35  (via drill 0.38)
  Top 0.279: v77.02,54.96 77.05,54.98 R11.2 R10.1 | U6.P$6 72.93,51.02 v72.96,51.04
  Route15 0.279: v72.96,51.04 72.96,53.33 74.58,54.96 v77.02,54.96
N$36
  Top 0.279: U6.P$8 71.07,49.38 70.93,49.52
  pour Top: 72.96,50.79 72.96,54.2 70.16,54.2 70.16,49.27 71.18,49.27 71.18,50.79
N$37
  Top 0.272: U6.P$14 72.43,44.89 R13.1
N$38
  Top 1.27: U9.1 62.59,80.89 65.18,78.31 Q2.2
N$39  (via drill 0.38)
  Top 0.272: R4.2 67.24,40.95 v67.22,40.93 | v50.3,43.31 50.57,43.04 U4.11
  Route15 0.272: v50.3,43.31 52.44,45.46 53.51,45.46 53.81,45.75 55.82,45.75 56.11,45.46 58.92,45.46 59.35,45.88 62.39,45.88 67.22,41.05 v67.22,40.93
N$40
  Top 1.27: U8.1 78.31,34.22 78.31,35.77 Q1.2
N$41
  pour Bottom (no thermals): 86.83,85.51 86.83,86.78 85.56,86.78 85.56,85.51
N$42
  pour Bottom (no thermals): 6.05,85.51 6.05,86.78 4.78,86.78 4.78,85.51
N$43
  Route15 1.27: J3.3 54.16,7.4 | 54.16,7.4 60.65,7.4 62.84,9.6 71.11,9.6 73.3,7.4 76.77,7.4 83.37,14.01 83.37,57.82 83.15,58.05 83.15,62.57 79.07,66.65 JP10.2 | J3.2 54.29,7.53 54.16,7.4
  pour Route15 (no thermals): 77.91,68.44 77.91,65.65 85.15,65.65 85.15,78.48 77.78,78.48 77.78,75.81 77.78,72.76 80.83,72.76 80.83,68.57 80.83,68.44
N$44
  Top 0.272: Q11.1 25.46,4.44 R30.1 29.82,2.42 Q7.3
N$45
  pour Top (no thermals): 4.78,86.78 6.05,86.78 6.05,85.51 4.78,85.51
N$46  (via drill 0.38)
  Top 0.279: U7.3 59.13,74.87 C26.1 v59.24,76.19 | R17.2 v52.13,76.19
  Route15 0.61: v59.24,76.19 57.72,77.71 53.65,77.71 v52.13,76.19
N$47
  Top 0.272: 79.31,13.24 R29.1 79.24,12.97 Q10.1 78.2,9.73 75.52,9.73 Q6.3
N$48
  pour Top (no thermals): 85.56,86.78 86.83,86.78 86.83,85.51 85.56,85.51
N$49  (via drill 0.38)
  Top 0.272: U13.RXON 21.29,12.51 v21.25,12.55 | U13.GPIO_0 25.36,11.09 v25.36,12.52
  Route15 0.272: v21.25,12.55 25.32,12.55 v25.36,12.52
N$50
  pour Top (no thermals): 85.56,11.09 86.83,11.09 86.83,9.82 85.56,9.82
N$51
  Top 0.279: C25.1 58.48,73.74 58.48,72.38 58.48,71.62 U7.4
N$52
  Top 0.279: U7.2 59.78,75.2 60.51,75.94
  pour Top: 61.53,80 61.53,75.94 60.51,75.94 60.51,76.95 58.23,76.95 58.23,80
N$53  (via drill 0.38)
  Top 0.272: U4.13 52.57,43.17 v52.98,42.75 | D2.C v37.77,15.23
  Route15 0.272: v52.98,42.75 53.65,42.09 53.65,41 54.52,40.13 54.52,32.62 37.77,15.87 v37.77,15.23
N$54  (via drill 0.38)
  Top 0.272: U6.P$11 70.67,47.83 v70.56,47.72
  Bottom 0.272: R41.1 70.13,46.8 70.13,47.29 v70.56,47.72
N$55  (via drill 0.38)
  Top 0.272: U13.TXON 19.29,12.54 v19.32,12.56 | U13.GPIO_1 27.29,12.53 v27.28,12.54
  Route15 0.272: v19.32,12.56 20.14,13.39 26.44,13.39 v27.28,12.54
N$56
  Top 0.272: Q14.3 64.4,9.64 Q13.1 65.43,10.87 R7.1
N$57
  Top 0.272: Q14.1 59.64,12.34 R37.1
PGOOD
  Top 0.279: U7.6 57.18,72.16 56.96,72.38 56.28,73.05 R17.1
RF_IN
  Bottom 0.272: U12.4 19.03,30.02
  Bottom 0.279: 19.03,30.02 U14.11
RF_NIRQ  (via drill 0.38)
  Top 0.272: 46.57,43.52 v46.54,43.55 46.57,43.52 | 46.57,43.52 U4.3
  Top 0.279: U13.NIRQ 19.29,42.08 v19.24,42.03
  Route15 0.272: 43.49,40.5 43.75,40.76
  Route15 0.279: 43.75,40.76 v46.54,43.55 | 43.49,40.5 39.64,36.65 38.64,36.65 38.58,36.7 32.48,36.7 32.47,36.69 24.57,36.69 v19.24,42.03
RF_SDN  (via drill 0.38)
  Top 0.272: U13.SDN 17.33,43.87 | 17.33,43.79 v17.33,42.15 | U4.4 47.07,42.94 v47.43,43.3
  Top 0.279: U13.SDN 17.33,43.79
  Route15 0.279: v17.33,42.15 25.21,34.28 38.41,34.28 v47.43,43.3
SPI_CS_MRAM  (via drill 0.38)
  Top 0.272: U4.38 43.14,48.4 v42.83,48.71
  Route15 0.272: v32.09,45.24 33.64,46.79 41.77,46.79 42.83,47.86 v42.83,48.71
  Bottom 0.272: U20.1 31.32,44.48 v32.09,45.24
SPI_CS_RFM  (via drill 0.38)
  Top 0.272: U13.NSEL 21.29,45.43 v21.27,45.46 | U4.48 43.12,43.4 42.95,43.23 42.86,43.23 v42.56,42.92
  Route15 0.272: v21.27,45.46 23.93,42.8 42.43,42.8 v42.56,42.92
SPI_CS_SD  (via drill 0.38)
  Top 0.272: U4.29 49.07,51.28 48.81,51.54 48.81,52.44 v48.59,52.66
  Route15 0.272: v48.59,52.66 48.59,51.57 48.07,51.04 45.27,51.04 42.48,53.84 42.48,88.89 36.9,94.46 v36.9,94.64
  Bottom 0.272: J1.2 36.91,94.65 v36.9,94.64
SPI_CS_XTB1  (via drill 0.38)
  Top 0.272: U15.P$7 v25.14,60.95 | U4.41 45.24,46.9 v45.54,46.6
  Route15 0.272: v45.54,46.6 43.1,46.6 40.63,44.13 27.62,44.13 23.86,47.9 23.86,59.67 v25.14,60.95
SPI_CS_XTB2  (via drill 0.38)
  Top 0.272: U16.P$7 31.62,70.98 v33.21,70.98 | U4.37 44.07,49.79 v43.12,50.74
  Route15 0.272: v43.12,50.74 36.47,50.74 32.23,54.98 32.23,70 v33.21,70.98
SPI_CS_XTB3  (via drill 0.38)
  Top 0.272: U4.25 51.07,51.39 v51.34,51.65
  Route15 0.272: v25.04,71.11 23.13,69.2 23.13,46.77 26.22,43.68 40.74,43.68 42.05,44.99 44.89,44.99 45.83,45.93 47.29,45.93 49.51,48.16 49.51,49.4 51.28,51.16 51.28,51.6 v51.34,51.65
  Bottom 0.272: U17.P$7 v25.04,71.11
SPI_CS_XTB4  (via drill 0.38)
  Top 0.272: U4.28 49.57,51.72 v49.53,51.76
  Route15 0.272: v49.53,51.76 48.34,50.58 44.7,50.58 34.32,60.95 v33.21,60.95
  Bottom 0.272: U18.P$7 v33.21,60.95
SPI_MISO  (via drill 0.38)
  Top 0.272: 27.29,44.14 U13.SDO 27.74,44.28 v27.74,45.31 | v28.9,67.46 27.91,67.46 U15.P$4 26.79,68.63 27.49,69.33 | U16.P$4 30.42,62.42 v29.06,62.42 | U4.30 48.57,49.52 48.93,49.17 v48.93,48.72
  Route15 0.272: v48.93,48.72 47.7,47.49 43.24,47.49 40.44,44.69 v30.67,44.69 28.36,44.69 v27.74,45.31 25.64,47.4 25.64,58.16 29.06,61.58 v29.06,62.42 27.54,63.94 27.54,66.1 v28.9,67.46 27.44,68.92 27.44,89.94 31.42,93.92 v31.42,94.65
  Bottom 0.272: J1.7 v31.41,94.66 v31.42,94.65 | U17.P$4 27.86,62.42 v29.06,62.42 | 30.73,69.33 U18.P$4 30.38,67.46 v28.9,67.46 | U20.2 30.05,44.08 v30.67,44.69
SPI_MOSI  (via drill 0.38)
  Top 0.272: 25.33,43.87 U13.SDI v25.29,45.57 | 30.73,69.33 U16.P$6 30.66,69.4 v29.35,69.4 | U15.P$6 27.91,64.61 v29.22,64.61 | U4.31 v48.07,49.08
  Route15 0.272: v48.07,49.08 47.43,49.71 43.55,49.71 43.54,49.71 42.75,49.71 41.7,49.71 40.1,48.11 30.34,48.11 v27.98,50.47 27.98,53.8 30.94,56.76 30.94,62.87 29.22,64.59 v29.22,64.61 30.79,66.19 30.79,67.34 30.79,67.96 v29.35,69.4 40.33,80.38 40.33,90.11 v35.81,94.64
  Bottom 0.272: 27.55,69.33 U17.P$6 27.62,69.4 v29.35,69.4 | J1.3 v35.81,94.64 | U18.P$6 30.37,64.61 v29.22,64.61 | v27.98,50.47 27.51,50 U20.5 27.51,48.24 25.29,46.02 v25.29,45.57
SPI_SCK  (via drill 0.38)
  Top 0.272: U17.P$5 v29.65,66.03 U18.P$5 | U4.32 47.57,49.56 47.05,49.04 v47.05,48.38 | U13.SCK 23.29,45.47 v23.31,45.49
  Route15 0.272: v47.05,48.38 47,48.42 45.18,48.42 44.3,49.31 43.71,49.31 42.59,49.31 42.03,49.31 40.39,47.68 29.21,47.68 29.14,47.68 v28.76,48.06 27.43,49.4 27.43,56.14 30.35,59.06 30.35,62.52 28.48,64.4 28.48,65.17 29.34,66.03 v29.65,66.03 29.66,66.03 30.18,66.55 30.18,67.75 28.67,69.27 28.67,69.68 31.03,72.04 31.03,92.06 v33.62,94.65
  Bottom 0.272: U17.P$5 v29.65,66.03 U18.P$5 | J1.5 v33.61,94.65 v33.62,94.65 | U20.6 28.78,48.08 | 28.78,48.08 v28.76,48.06 | v23.31,45.49 24.59,45.49 25.06,45.02 25.72,45.02 28.78,48.08
SWCLK  (via drill 0.38)
  Top 0.272: U4.45 45.48,44.9 v46.03,45.2
  Route15 0.279: JP26.1 39.73,38.09 46.03,44.39 v46.03,45.2
SWDIO  (via drill 0.38)
  Top 0.272: U4.46 42.84,44.4 v42.55,44.19
  Route15 0.279: JP25.1 41.29,40.63 43.12,42.46 43.12,43.62 v42.55,44.19
UART1_RX  (via drill 0.38)
  Top 0.272: U4.8 49.07,40.9 v49.25,40.72
  Route15 0.272: v32.83,21.83 49.25,38.26 v49.25,40.72
  Bottom 0.272: U14.20 32.49,21.5 v32.83,21.83
UART1_TX  (via drill 0.38)
  Top 0.272: U4.7 48.57,40.79 v48.46,40.68
  Route15 0.272: v32.78,20.41 32.06,21.12 32.06,22.4 48.46,38.79 v48.46,40.68
  Bottom 0.279: U14.21 32.77,20.4 v32.78,20.41
USB_D+  (via drill 0.38)
  Top 0.272: U4.34 46.57,51.27 v46.03,51.81 | J2.3 49.05,90.24 49.05,89.44 48.7,89.1 v48.7,89.06
  Route15 0.279: v46.03,51.81 46.52,52.3 46.52,55 46.52,77.41 48.7,79.58 v48.7,89.06
USB_D-  (via drill 0.38)
  Top 0.272: U4.33 47.07,51.32 v47.56,51.81 | J2.2 49.73,89.16 v49.59,89.02
  Route15 0.279: v49.59,89.02 49.38,88.81 49.38,88.78 49.23,88.62 49.23,79.37 47.05,77.19 47.05,55.05 47.05,52.19 47.43,51.81 v47.56,51.81
VBATT  (via drill 0.38, 1.02)  (1 unrouted)
  Top 0.272: R6.2 58.1,47.83 v58.1,48.63 | U7.7 v55.84,71.09
  Top 0.406: U5.4 65.78,56.32 v65.85,56.25
  Top 0.61: 65.61,76.95 v65.26,76.95
  Top 1.27: JP16.1 72.92,63.2 75.37,65.65 75.37,79.06 U9.14 | Q1.3 79.65,36.48 v79.68,36.45
  Route15 0.279: v58.1,48.63 58.1,50.66 63.69,56.25 v65.85,56.25 | v55.84,71.09 59.09,74.34 61.58,74.34 64.2,76.95 v65.26,76.95
  Route15 1.27: J3.1 49.75,13.4 51.44,15.09 63.18,15.09 64.44,13.83 75.7,13.83 U8.14 80.2,18.33 80.2,35.93 v79.68,36.45 79.68,37.41 | v65.26,76.95 67.88,76.95 69.1,75.73 69.1,66.04 JP16.1 75.54,59.59 77.37,59.59 78.8,58.16 78.8,55.11 81.15,52.76 81.15,40.58 79.68,39.11 79.68,37.41 | 79.68,37.41
  other vias: 71.87,59.1
  pour Top: 62.93,57.01 62.93,55.49 66.35,55.49 66.35,54.85 74.99,54.85 74.99,65.01 66.1,65.01 66.1,57.01
VBATT_IN
  pour Top (isolate 0.254, rank 2): 49.21,85.18 49.21,81.69 66.1,81.78 66.1,65.52 75.37,65.52 75.37,57.01 83.63,57.01 83.63,83.81 arc90 82.36,85.08
VBURN1
  pour Top: 2.6,57.39 6.66,57.39 6.66,52.82 7.68,52.82 7.68,51.81 5.14,51.81 5.14,51.04 2.6,51.04
VBURN2
  Top 0.272: JP5.3 85.87,50.54 84.64,50.54 | 84.64,50.54 84.64,50.92 | JP5.3 86,50.54 87.06,50.54 | 87.06,50.54 87.18,50.54 87.18,51.17 | JP5.3 85.93,49.28 | 85.91,49.26 85.93,49.28 | 85.93,49.28 84.66,49.28 84.64,49.27 84.64,50.54 | 85.93,49.28 87.04,49.28 87.06,49.27 87.06,50.54
  pour Top (rank 2): 87.18,49.01 84.64,49.01 84.64,51.93 82.74,51.93 82.74,53.84 87.18,53.84
VBURN3
  pour Top: 20.67,6.52 20.67,2.97 23.97,2.97 23.97,6.52
VBURN4
  Top 0.406: JP8.3 76.71,4.62 76.64,4.69 76.64,5.58
  pour Top: 76.51,4.56 76.51,9.52 79.31,9.52 79.31,4.56
VBURN5
  Top 0.272: JP7.3 63.25,4.62 63.16,4.71 63.16,4.82
  pour Top: 63.18,4.44 63.18,9.39 65.97,9.39 65.97,4.44
VBURN_A_IN  (via drill 0.38)
  Top 0.272: R32.2 5.42,53.22 Q9.2
  Top 0.508: Q12.2 82.93,56.53 R31.2 v81.85,56.76
  Top 1.27: U9.11 63.52,82.78 53.9,82.78 51.97,80.85 48.41,80.85 45.32,83.94 8.82,83.94 7.55,82.67 7.55,53.28 R32.2
  Route15 1.27: v81.85,56.76 81.85,57.52 76.64,62.73 76.64,72.68 68.43,80.89 U9.11
VBURN_B_IN  (via drill 0.38)
  Top 0.272: 63.73,10.87 Q13.2
  Top 0.406: Q13.2 63.56,10.84 v63.56,11.67 63.56,12.65 R7.2
  Top 0.508: Q11.2 25.46,6.14 v26.52,6.14 R30.2 | v77.44,11.8 77.44,10.87
  Route15 1.27: 53.47,13.43 50.54,10.5 48.9,10.5 45.57,7.16 33.92,7.16 33.01,6.26 26.64,6.26 v26.52,6.14 | 53.47,13.43 | 53.47,13.43 61.81,13.43 v63.56,11.67 77.31,11.67 v77.44,11.8
  pour Top: 75.24,24.88 79.18,24.88 79.18,10.15 75.24,10.15
VDDCORE3
  Top 0.272: U4.43 41.86,45.9 41.83,45.88 41.49,45.54 40.87,45.54 C10.1
VREG_IN
  Top 0.272: 63.31,65.65 62.58,65.65 C21.1 62.54,66.45 60.55,66.45 | 60.55,66.45 60.39,66.28 | 60.55,66.45 59.91,66.45 59.75,66.28 | U5.5 64.2,58.17 64.2,57.65 | 64.2,57.65 63.43,57.65 63.18,57.9 | 64.2,57.65 65.08,57.65 65.34,57.9
  pour Top: 59.5,66.28 59.5,62.98 60.77,62.98 60.77,57.95 65.54,57.95 65.54,66.28 63.18,66.28
VSOLAR  (via drill 1.02)
  Route15 1.27: JP9.2 18.31,4.6 20.44,2.47 37.71,2.47 JP14.2 41.51,2.47 60.06,2.47 JP7.2
  other vias: 3.59,81.55
  pour Top (isolate 0.254, rank 3): 78.49,39.36 78.49,7.1 61.53,7.1 61.53,0.37 90.23,0.35 90.23,93.86 arc90 88.45,96 55.94,95.88 54.67,94.99 43.88,94.99 42.48,96 16.32,96 16.32,84.95 16.44,84.83 44,84.83 45.65,84.83 48.83,81.65 48.83,85.46 49.06,85.46 49.1,85.42 81.5,85.33 arc-90 84.12,82.7 83.88,39.36
  pour Top (isolate 0.254, rank 4): 16.95,84.06 9.7,84.06 arc90 7.26,81.63 7.16,54.32 arc-90 6.3,53.46 0.06,53.46 0.06,95.88 16.81,95.88
  pour Top (no thermals): 30.03,95.75 38.16,95.75 38.16,94.22 30.03,94.22
VSOLAR_IN
  Top 0.279: U6.P$3 76.18,48.33 76.26,48.25
  pour Top (isolate 0.254, rank 4): 79.56,45.71 76.01,45.71 74.99,46.73 74.99,51.55 79.31,51.55 79.31,56.63 83.25,56.63 83.25,39.87 79.56,39.87
WDT_WDI  (via drill 0.38)
  Top 0.272: U4.26 50.57,52.4 v51.27,53.1
  Bottom 0.272: U1.6 52.21,54.55 51.27,53.61 v51.27,53.1 54.44,53.1 R42.2
XTB_RESET  (via drill 0.38)
  Top 0.272: U16.P$3 30.73,60.19 v29.32,60.19 | U15.P$3 26.92,70.98 v29.14,70.98 | U4.39 41.95,47.9 v41.76,47.71
  Route15 0.272: v29.14,70.98 28.03,69.87 28.03,69.22 29.58,67.67 29.58,66.97 27.98,65.38 27.98,64.3 29.66,62.63 29.66,60.53 v29.32,60.19 26.45,57.32 26.45,49.08 28.28,47.25 40.81,47.25 41.24,47.68 41.76,47.68 v41.76,47.71
  Bottom 0.272: U17.P$3 27.55,60.19 v29.32,60.19 | v29.14,70.98 31.36,70.98 U18.P$3

## Text on the board
Top: KMB-23 | LYR 1
Route2: LYR 2
Route15: LYR 3
Bottom: KMB-23 | LYR 4
tPlace: SOLAR | M+C | ANTENNA 2 | ANTENNA 1 | github.com/kicksat | DEPOLY 1 | DEPOLY 2 | DEPOLY 3
bPlace: SOLAR | github.com/kicksat
tNames: GND | VSOL | VSOL | GND | VSOLAR | Rail / Switch | - | SENSOR 1 | SENSOR 2 | + | - | Batteries | + | GND | VBATT | VSOL | VBURN | VBURN | !RESET | VSOL | 3.3V | GND | JTAG | GND | SDO_A/G | CS_M | SWDIO | GPS1 | SWCLK | IMU / CONFIG | 3.3V | SDO_M | CS_A/G | GND | GPS2 | KMB-23 | GND | VSOL | VBURN | GND | VSOL | GND | VSOL | VBURN | GND | VSOL | VBURN | SOLAR | 4.5V / TO / 18V
bNames: VSOL | GND | GND | VSOL | 2 | SENSOR 3 | SENSOR 4 | 1 | Footswitch | GND | VSOL | VBURN | VBURN | VSOL | GND | GPS !RST | RADIO | GND | VSOL | VBURN | GND | VSOL | GND | VSOL | VBURN | GND | VSOL | VBURN
Document: Passive grid = 10mils / IC grid = 50 mils / Fanout grid = 2mil RFM,